# Altium schematic sheet SH8 - LOAD MONITORING 2.SchDoc: Power Distribution Board Rev2 - Load Monitoring 2
size Letter; DrawnBy: Cindy Li; Organization: UW Robotics; Address1: 200 University Avenue; Address2: Waterloo; Address3: Ontario; Address4: Canada N2L 3G6; DocumentNumber: 8; SheetNumber: 8; SheetTotal: 11
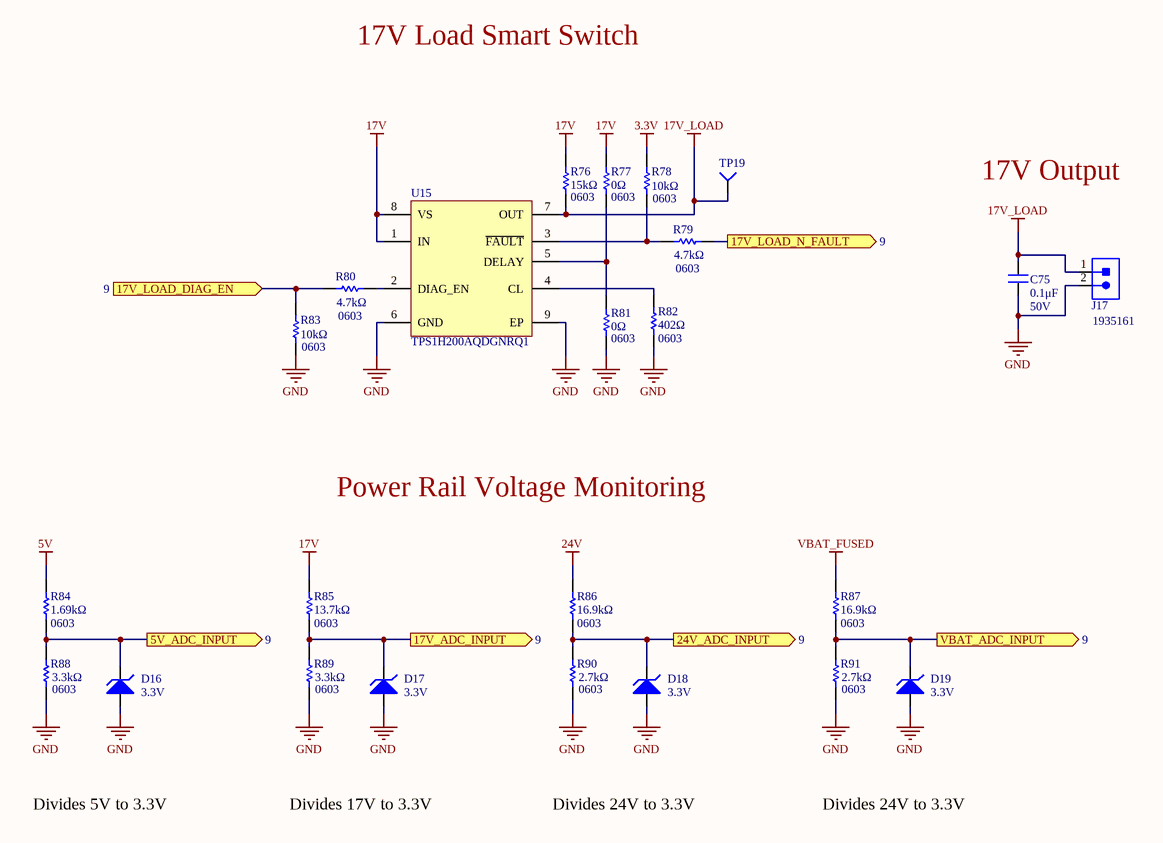
[diagram p0: SH8 - LOAD MONITORING 2.SchDoc]

## Parts
C75  0.1μF  Voltage Rating: 50V  [CAP2012]
D16  Reverse Standoff Voltage: 3.3V  [SOD523_UNI]  (hidden comment: ESD5Z3.3T1G)
D17  Reverse Standoff Voltage: 3.3V  [SOD523_UNI]  (hidden comment: ESD5Z3.3T1G)
D18  Reverse Standoff Voltage: 3.3V  [SOD523_UNI]  (hidden comment: ESD5Z3.3T1G)
D19  Reverse Standoff Voltage: 3.3V  [SOD523_UNI]  (hidden comment: ESD5Z3.3T1G)
J17  1935161  [1935161]
R76  value 15kΩ  Case Code (Imperial): 0603  [RESC0603(1608)_N]  (hidden comment: RES_15kΩ_0603)
R77  value 0Ω  Case Code (Imperial): 0603  [RESC0603(1608)_N]  (hidden comment: RES_0Ω_0603)
R78  value 10kΩ  Case Code (Imperial): 0603  [RESC0603(1608)_N]  (hidden comment: RES_10kΩ_0603)
R79  value 4.7kΩ  Case Code (Imperial): 0603  [RESC0603(1608)_N]  (hidden comment: RES_4.7kΩ_0603)
R80  value 4.7kΩ  Case Code (Imperial): 0603  [RESC0603(1608)_N]  (hidden comment: RES_4.7kΩ_0603)
R81  value 0Ω  Case Code (Imperial): 0603  [RESC0603(1608)_N]  (hidden comment: RES_0Ω_0603)
R82  Resistance: 402Ω  Case Code (Imperial): 0603  [RESC0603(1608)_N]  (hidden comment: RES_402Ω_0603)
R83  value 10kΩ  Case Code (Imperial): 0603  [RESC0603(1608)_N]  (hidden comment: RES_10kΩ_0603)
R84  value 1.69kΩ  Case Code (Imperial): 0603  [RESC0603(1608)_N]  (hidden comment: RES_1.69kΩ_0603)
R85  value 13.7kΩ  Case Code (Imperial): 0603  [RESC0603(1608)_N]  (hidden comment: RES_13.7kΩ_0603)
R86  value 16.9kΩ  Case Code (Imperial): 0603  [RESC0603(1608)_N]  (hidden comment: RES_16.9kΩ_0603)
R87  value 16.9kΩ  Case Code (Imperial): 0603  [RESC0603(1608)_N]  (hidden comment: RES_16.9kΩ_0603)
R88  value 3.3kΩ  Case Code (Imperial): 0603  [RESC0603(1608)_N]  (hidden comment: RES_3.3kΩ_0603)
R89  value 3.3kΩ  Case Code (Imperial): 0603  [RESC0603(1608)_N]  (hidden comment: RES_3.3kΩ_0603)
R90  value 2.7kΩ  Case Code (Imperial): 0603  [RESC0603(1608)_N]  (hidden comment: RES_2.7kΩ_0603)
R91  value 2.7kΩ  Case Code (Imperial): 0603  [RESC0603(1608)_N]  (hidden comment: RES_2.7kΩ_0603)
TP19  TESTPOINT_1MM_CIRCLE  [TESTPOINT_CIRCLE_1MM]  (value not drawn)  (no BOM)
U15  Manufacturer Part Number 1: TPS1H200AQDGNRQ1  [DGN0008G]  (hidden comment: TPS1H200A-Q1)

## Ports
5V_ADC_INPUT (out, see 9), 17V_ADC_INPUT (out, see 9), 17V_LOAD_DIAG_EN (in, see 9), 17V_LOAD_N_FAULT (out, see 9), 24V_ADC_INPUT (out, see 9), VBAT_ADC_INPUT (out, see 9)

## Nets
3.3V: R78.2
5V: R84.2
17V: R76.2 R77.2 R85.2 U15.1(IN) U15.8(VS)
17V_LOAD: C75.2 J17.1 R76.1 TP19.1(=value) U15.7(OUT)
24V: R86.2
GND: C75.1 D16.1 D17.1 D18.1 D19.1 J17.2 R81.1 R82.1 R83.1 R88.1 R89.1 R90.1 R91.1 U15.6(GND) U15.9(EP)
VBAT_FUSED: R87.2
5V_ADC_INPUT: D16.2 R84.1 R88.2 ; port 5V_ADC_INPUT
17V_ADC_INPUT: D17.2 R85.1 R89.2 ; port 17V_ADC_INPUT
17V_LOAD_DIAG_EN: R80.1 R83.2 ; port 17V_LOAD_DIAG_EN
17V_LOAD_N_FAULT: R79.2 ; port 17V_LOAD_N_FAULT
24V_ADC_INPUT: D18.2 R86.1 R90.2 ; port 24V_ADC_INPUT
VBAT_ADC_INPUT: D19.2 R87.1 R91.2 ; port VBAT_ADC_INPUT
NetR77_1: R77.1 R81.2 U15.5(DELAY)
NetR78_1: R78.1 R79.1 U15.3(~{FAULT})
NetR80_2: R80.2 U15.2(DIAG_EN)
NetR82_2: R82.2 U15.4(CL)

## Notes on the sheet
- 17V Load Smart Switch
- 17V Output
- Power Rail Voltage Monitoring
- Divides 5V to 3.3V
- Divides 17V to 3.3V
- Divides 24V to 3.3V
- Title
- Size:
- Date:
- Letter
- Drawn By:
- Sheet
- of
- File:

## Library data of the parts
C75 = CAP_0.1uF_50V_0805: CAP CER 0.1UF 50V X7R 0805; Manufacturer 1: Murata Electronics; Manufacturer Part Number 1: GCD21BR71H104KA01L; Tolerance: 10%; Mount: Surface Mount; Case Code (Metric): 2012; Case Code (Imperial): 0805; Min Operating Temperature: -55°C; Max Operating Temperature: 125°C; Dielectric: X7R; Termination: SMD/SMT; Length: 2mm; Height: 1.25mm; Width: 0.049inch; Thickness: 0.049inch; Depth: 1.25mm; Ratings: AEC-Q200; Supplier 1: Digi-Key; Supplier Part Number 1: 490-11955-1-ND; Package: 0805 (2012 Metric); Value: 0.1μF
D16-D19 = ESD5Z3.3T1G: ESD5Z3.3T1G,SOD523 ESD DIODE < AZ; Manufacturer 1: ON Semiconductor; Clamping Voltage: 14.1V; Peak Pulse Power: 158W; Number of Unidirectional Channels: 1; Min Breakdown Voltage: 5V; Power Line Protection: No; Peak Pulse Current: 11.2A; Polarity: Unidirectional; ESD Protection: Yes; Capacitance: 105pF; Max Reverse Leakage Current: 50nA; Test Current: 1mA; Max Power Dissipation: 200mW; Element Configuration: Single; Supplier 1: Digi-Key; Category: ESD and Circuit Protection ICs; Case/Package: SOD-523-2; Number of Pins: 2; Contact Plating: Tin,Matte; Min Operating Temperature: -55°C; Max Operating Temperature: 150°C; Composition: Zener; Number of Lines: 1; Breakdown Voltage: 5V; Termination: SMD/SMT; Number of Elements: 1; Max Breakdown Voltage: 5V; Reverse Breakdown Voltage: 5V; Leakage Current: 50nA; Number of Channels: 1; Operating Supply Voltage: 3.3V; Max Surge Current: 11.2A; Working Voltage: 3.3V; Direction: Unidirectional; Length: 1.2mm; Height: 0.6mm; Width: 0.8mm; Depth: 0.8mm; Halogen Free: Halogen Free; REACH SVHC: No SVHC; ComponentLink7URL: https://datasheet.ciiva.com/3304/esd5z2-5t1-d-3304008.pdf?src-supplier=Avnet; ComponentLink7Description: https://datasheet.ciiva.com/3304/esd5z2-5t1-d-3304008.pdf?src-supplier=Avnet; ComponentLink8URL: https://datasheet.ciiva.com/339/esd5z2-5t1-d-339753.pdf?src-supplier=Digi-Key; ComponentLink8Description: https://datasheet.ciiva.com/339/esd5z2-5t1-d-339753.pdf?src-supplier=Digi-Key; ComponentLink9URL: https://datasheet.ciiva.com/22637/1878252-22637179.pdf?src-supplier=Element14; ComponentLink9Description: https://datasheet.ciiva.com/22637/1878252-22637179.pdf?src-supplier=Element14; ComponentLink10URL: https://datasheet.ciiva.com/16472/esd5z2-5t1-d-16472397.pdf?src-supplier=Avnet+Asia; ComponentLink10Description: https://datasheet.ciiva.com/16472/esd5z2-5t1-d-16472397.pdf?src-supplier=Avnet+Asia; ComponentLink11URL: https://datasheet.ciiva.com/22637/1878252-22637181.pdf?src-supplier=Element14; ComponentLink11Description: https://datasheet.ciiva.com/22637/1878252-22637181.pdf?src-supplier=Element14; Supplier Part Number 1: ESD5Z3.3T1GOSCT-ND; Manufacturer Part Number 1: ESD5Z3.3T1G
J17 = CON_2M_TERM: TERM BLK 2POS SIDE ENTRY 5MM; Manufacturer 1: Phoenix Contact; Connector Type: Screw; Voltage Rating (DC): 320V; Max Current Rating: 16A; Max Supply Voltage: 250V; Current Rating: 17.5A; Number of Poles: 2; Number of Levels: 1; Current: 18A; Voltage: 300V; Wire Gauge (Max): 26AWG; Wire Gauge (Min): 12AWG; Approvals: UL; Supplier 1: Digi-Key; Mount: Through Hole; Number of Pins: 2; Weight: 0.067021oz; Contact Material: Copper,Tin; Insulation Material: Nylon; Housing Material: Polyamide; Housing Color: Green; Color: Green; Material: Nylon; Number of Rows: 1; Voltage Rating: 250V; Number of Positions: 2; Number of Positions Per Level: 2; Termination: Solder; Number of Contacts: 2; Number of Circuits: 2; Orientation: Straight; Length: 9mm; Height: 11.3mm; Width: 14.9mm; Pitch: 5mm; Depth: 9mm; Wire/Cable Gauge: 26AWG; Flammability Rating: UL94 V-0; REACH SVHC: Unknown; Supplier Part Number 1: 277-1667-ND; Manufacturer Part Number 1: 1935161
R76 = RES_15kΩ_0603_5%: RES 15K OHM 5% 1/10W 0603; Manufacturer 1: Yageo; Manufacturer Part Number 1: RC0603JR-0715KL; Package: 0603 (1608 Metric); Dimensions: 0.063" L x 0.031" W (1.60mm x 0.80mm); Supplier Part Number 1: 311-15KGRCT-ND; Supplier 1: Digi-Key; Mount: Surface Mount; Case Code (Metric): 1608; Tolerance: 5%
R77 R81 = RES_0Ω_0603: RES 0 OHM JUMPER 1/10W 0603; Manufacturer 1: Yageo; Manufacturer Part Number 1: RC0603JR-070RL; Package: 0603 (1608 Metric); Dimensions: 0.063" L x 0.031" W (1.60mm x 0.80mm); Supplier Part Number 1: 311-0.0GRCT-ND; Supplier 1: Digi-Key; Mount: Surface Mount; Case Code (Metric): 1608
R78 R83 = RES_10kΩ_0603_5%: RES 10K OHM 5% 1/10W 0603; Manufacturer 1: Yageo; Manufacturer Part Number 1: RC0603JR-0710KL; Package: 0603 (1608 Metric); Dimensions: 0.063" L x 0.031" W (1.60mm x 0.80mm); Supplier Part Number 1: 311-10KGRCT-ND; Supplier 1: Digi-Key; Mount: Surface Mount; Case Code (Metric): 1608; Tolerance: 5%
R79 R80 = RES_4.7kΩ_0603_5%: RES 4.7K OHM 5% 1/10W 0603; Manufacturer 1: Yageo; Manufacturer Part Number 1: RC0603JR-074K7L; Package: 0603 (1608 Metric); Dimensions: 0.063" L x 0.031" W (1.60mm x 0.80mm); Supplier Part Number 1: 311-4.7KGRCT-ND; Supplier 1: Digi-Key; Mount: Surface Mount; Case Code (Metric): 1608; Tolerance: 5%
R82 = RES_402Ω_0603_0.5%: RES 402 OHM 0.5% 1/10W 0603; Manufacturer 1: Yageo; Manufacturer Part Number 1: RT0603DRD07402RL; Power Rating: 100mW; Voltage Rating: 75V; Temperature Coefficient: 25ppm/°C; Voltage Rating (DC): 50V; Value: 402Ω; Supplier 1: Digi-Key; Min Operating Temperature: -55°C; Max Operating Temperature: 125°C; Termination: SMD/SMT; Length: 1.6mm; Width: 0.8mm; Supplier Part Number 1: 311-402DCT-ND; Dimensions: 0.063" L x 0.031" W (1.60mm x 0.80mm); Mount: Surface Mount; Package: 0603 (1608 Metric); Case Code (Metric): 1608; Height: 0.45mm; Weight: 7.1E-05oz; Tolerance: 0.5%
R84 = RES_1.69kΩ_0603_1%: RES SMD 1.69K OHM 1% 1/10W 0603; Manufacturer 1: Yageo; Manufacturer Part Number 1: RC0603FR-071K69L; Dimensions: 0.063" L x 0.031" W (1.60mm x 0.80mm); Package: 0603 (1608 Metric); Supplier Part Number 1: 311-1.69KHRCT-ND; Supplier 1: Digi-Key; Mount: Surface Mount; Case Code (Metric): 1608; Tolerance: 1%
R85 = RES_13.7kΩ_0603_1%: RES SMD 13.7K OHM 1% 1/10W 0603; Manufacturer 1: Yageo; Manufacturer Part Number 1: RC0603FR-0713K7L; Dimensions: 0.063" L x 0.031" W (1.60mm x 0.80mm); Package: 0603 (1608 Metric); Supplier Part Number 1: 311-13.7KHRCT-ND; Supplier 1: Digi-Key; Mount: Surface Mount; Case Code (Metric): 1608; Tolerance: 1%
R86 R87 = RES_16.9kΩ_0603_1%: RES SMD 16.9K OHM 1% 1/10W 0603; Manufacturer 1: Yageo; Manufacturer Part Number 1: RC0603FR-0716K9L; Dimensions: 0.063" L x 0.031" W (1.60mm x 0.80mm); Package: 0603 (1608 Metric); Supplier Part Number 1: 311-16.9KHRCT-ND; Supplier 1: Digi-Key; Mount: Surface Mount; Case Code (Metric): 1608; Tolerance: 1%
R88 R89 = RES_3.3kΩ_0603_1%: RES SMD 3.3K OHM 1% 1/10W 0603; Manufacturer 1: Yageo; Manufacturer Part Number 1: RT0603FRE073K3L; Dimensions: 0.063" L x 0.031" W (1.60mm x 0.80mm); Package: 0603 (1608 Metric); Supplier 1: Digi-Key; Supplier Part Number 1: YAG3354CT-ND; Mount: Surface Mount; Case Code (Metric): 1608; Tolerance: 1%
R90 R91 = RES_2.7kΩ_0603_1%: RES SMD 2.7K OHM 1% 1/10W 0603; Manufacturer 1: Yageo; Manufacturer Part Number 1: AC0603FR-072K7L; Dimensions: 0.063" L x 0.031" W (1.60mm x 0.80mm); Package: 0603 (1608 Metric); Supplier 1: Digi-Key; Supplier Part Number 1: YAG3589CT-ND; Mount: Surface Mount; Case Code (Metric): 1608; Tolerance: 1%
TP19 = TESTPOINT_1MM_CIRCLE: TESTPOINT 1MM CIRCLE; Part Number (MPN): *
U15 = TPS1H200A-Q1: IC PWR DRIVER N-CHAN 1:1 8MSOP; Manufacturer 1: Texas Instruments; Number of Outputs: 1; Output Configuration: High Side; Output Type: N-Channel; Supply Voltage: 4V - 40V; Output Current (Max): 2.5A; Rds On (Typ): 200mOhm; Supplier 1: Digi-Key; Supplier Part Number 1: 296-50416-1-ND; Operating Temperature: 40°C - 125°C; Mounting Type: Surface Mount; Package / Case: 8-TSSOP, 8-MSOP (0.118", 3.00mm Width) Exposed Pad